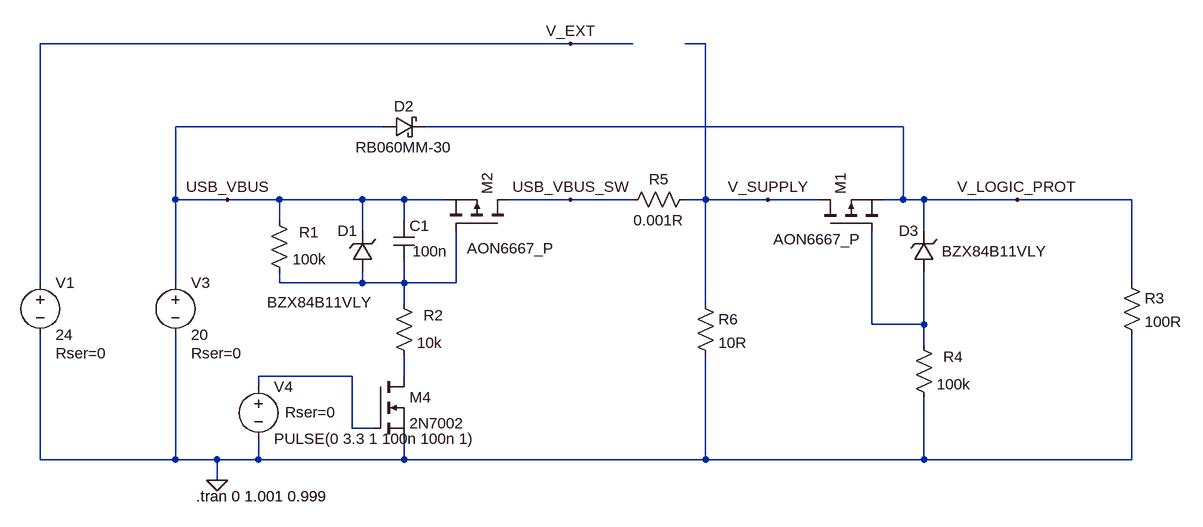
[diagram p0: schematic PowerInputSelectAndReverseVoltageProtection.asc]
PowerInputSelectAndReverseVoltageProtection.asc, the LTspice schematic file:
Version 4
SHEET 1 1284 680
WIRE 320 -368 -496 -368
WIRE 416 -368 320 -368
WIRE 528 -368 496 -368
WIRE 32 -240 -288 -240
WIRE 832 -240 96 -240
WIRE -288 -128 -288 -240
WIRE -208 -128 -288 -128
WIRE -128 -128 -208 -128
WIRE 0 -128 -128 -128
WIRE 64 -128 0 -128
WIRE 128 -128 64 -128
WIRE 320 -128 224 -128
WIRE 416 -128 320 -128
WIRE 528 -128 528 -368
WIRE 528 -128 496 -128
WIRE 624 -128 528 -128
WIRE 704 -128 624 -128
WIRE 832 -128 832 -240
WIRE 832 -128 800 -128
WIRE 864 -128 832 -128
WIRE 1008 -128 864 -128
WIRE 1184 -128 1008 -128
WIRE -128 -96 -128 -128
WIRE 64 -96 64 -128
WIRE 0 -80 0 -128
WIRE 864 -80 864 -128
WIRE -496 0 -496 -368
WIRE -288 0 -288 -128
WIRE -128 0 -128 -16
WIRE 0 0 0 -16
WIRE 0 0 -128 0
WIRE 64 0 64 -32
WIRE 64 0 0 0
WIRE 144 0 144 -80
WIRE 144 0 64 0
WIRE 1184 0 1184 -128
WIRE 64 32 64 0
WIRE 528 32 528 -128
WIRE 784 64 784 -80
WIRE 864 64 864 -16
WIRE 864 64 784 64
WIRE 864 96 864 64
WIRE -16 144 -160 144
WIRE 64 144 64 112
WIRE -160 160 -160 144
WIRE -16 224 -16 144
WIRE 16 224 -16 224
WIRE -496 272 -496 80
WIRE -288 272 -288 80
WIRE -288 272 -496 272
WIRE -224 272 -288 272
WIRE -160 272 -160 240
WIRE -160 272 -224 272
WIRE 64 272 64 240
WIRE 64 272 -160 272
WIRE 528 272 528 112
WIRE 528 272 64 272
WIRE 864 272 864 176
WIRE 864 272 528 272
WIRE 1184 272 1184 80
WIRE 1184 272 864 272
WIRE -224 304 -224 272
FLAG -224 304 0
FLAG 1008 -128 V_LOGIC_PROT
FLAG 624 -128 V_SUPPLY
FLAG 320 -368 V_EXT
FLAG 320 -128 USB_VBUS_SW
FLAG -208 -128 USB_VBUS
SYMBOL pmos 224 -80 M270
WINDOW 3 -27 63 VLeft 2
SYMATTR Value AON6667_P
SYMATTR InstName M2
SYMBOL voltage -288 -16 R0
WINDOW 123 0 0 Left 0
WINDOW 39 24 124 Left 2
SYMATTR SpiceLine Rser=0
SYMATTR InstName V3
SYMATTR Value 20
SYMBOL nmos 16 144 R0
SYMATTR InstName M4
SYMATTR Value 2N7002
SYMBOL voltage -160 144 R0
WINDOW 123 0 0 Left 0
WINDOW 39 41 55 Left 2
SYMATTR SpiceLine Rser=0
SYMATTR InstName V4
SYMATTR Value PULSE(0 3.3 1 100n 100n 1)
SYMBOL zener 16 -16 R180
WINDOW 0 24 64 Left 2
WINDOW 3 2 -46 Left 2
SYMATTR InstName D1
SYMATTR Value BZX84B11VLY
SYMBOL res 48 16 R0
WINDOW 0 46 34 Left 2
SYMATTR InstName R2
SYMATTR Value 10k
SYMBOL cap 48 -96 R0
WINDOW 3 29 47 Left 2
SYMATTR Value 100n
SYMATTR InstName C1
SYMBOL res 1168 -16 R0
SYMATTR InstName R3
SYMATTR Value 100R
SYMBOL res -144 -112 R0
WINDOW 0 46 34 Left 2
SYMATTR InstName R1
SYMATTR Value 100k
SYMBOL schottky 32 -224 R270
WINDOW 0 32 32 VTop 2
WINDOW 3 0 32 VBottom 2
SYMATTR InstName D2
SYMATTR Value RB060MM-30
SYMBOL pmos 704 -80 R270
WINDOW 3 -13 63 VLeft 2
SYMATTR Value AON6667_P
SYMATTR InstName M1
SYMBOL zener 880 -16 R180
WINDOW 0 24 64 Left 2
WINDOW 3 -173 33 Left 2
SYMATTR InstName D3
SYMATTR Value BZX84B11VLY
SYMBOL res 848 80 R0
WINDOW 0 46 34 Left 2
SYMATTR InstName R4
SYMATTR Value 100k
SYMBOL voltage -496 -16 R0
WINDOW 123 0 0 Left 0
WINDOW 39 24 124 Left 2
SYMATTR SpiceLine Rser=0
SYMATTR InstName V1
SYMATTR Value 24
SYMBOL res 512 -144 R90
WINDOW 0 0 56 VBottom 2
WINDOW 3 32 56 VTop 2
SYMATTR InstName R5
SYMATTR Value 0.001R
SYMBOL res 512 16 R0
SYMATTR InstName R6
SYMATTR Value 10R
TEXT -256 328 Left 2 !.tran 0 1.001 0.999

The netlist it stands for:
* PowerInputSelectAndReverseVoltageProtection.asc
M2 USB_VBUS_SW N001 USB_VBUS USB_VBUS AON6667_P
V3 USB_VBUS 0 20 Rser=0
M4 N004 N003 0 0 2N7002
V4 N003 0 PULSE(0 3.3 1 100n 100n 1) Rser=0
D1 N001 USB_VBUS BZX84B11VLY
R2 N001 N004 10k
C1 USB_VBUS N001 100n
R3 V_LOGIC_PROT 0 100R
R1 USB_VBUS N001 100k
D2 USB_VBUS V_LOGIC_PROT RB060MM-30
M1 V_SUPPLY N002 V_LOGIC_PROT V_LOGIC_PROT AON6667_P
D3 N002 V_LOGIC_PROT BZX84B11VLY
R4 N002 0 100k
V1 V_EXT 0 24 Rser=0
R5 V_SUPPLY USB_VBUS_SW 0.001R
R6 V_SUPPLY 0 10R
.model D D
.lib standard.dio
.model NMOS NMOS
.model PMOS PMOS
.lib standard.mos
.tran 0 1.001 0.999
.backanno
.end